# Altium schematic sheet ESP32WROOM-SHEET.SchDoc
size A; SheetNumber: 2; SheetTotal: 3
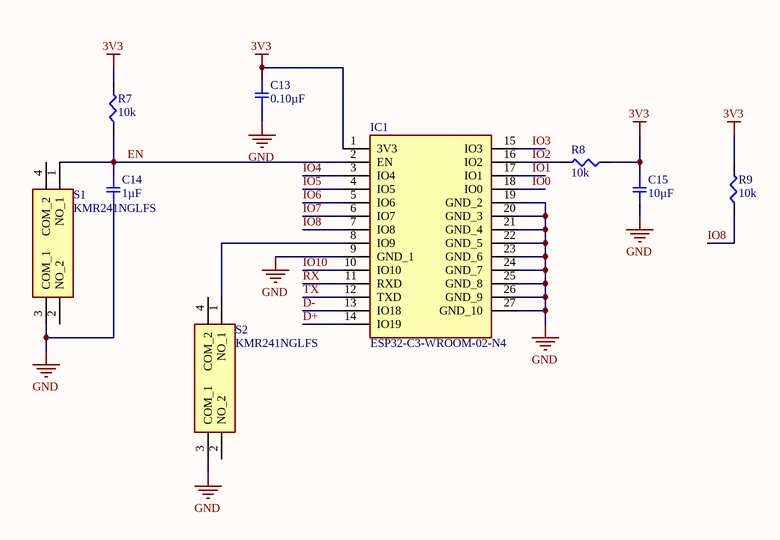
[diagram p0: ESP32WROOM-SHEET.SchDoc]

## Parts
C13  0.10µF  [SMD-0402C]
C14  1µF  [SMD-0402C]
C15  10µF  [SMD-0402C]
IC1  ESP32-C3-WROOM-02-N4  [ESP32C3WROOM02N4]
R7  10k  [SMD-0402-RES]
R8  10k  [SMD-0402-RES]
R9  10k  [SMD-0402-RES]
S1  KMR241NGLFS  [KMR241NGLFS]
S2  KMR241NGLFS  [KMR241NGLFS]

## Nets
3V3: C13.1 C15.1 IC1.1(3V3) R7.2 R8.1 R9.2
GND: C13.2 C14.2 C15.2 IC1.9(GND_1) IC1.19(GND_2) IC1.20(GND_3) IC1.21(GND_4) IC1.22(GND_5) IC1.23(GND_6) IC1.24(GND_7) IC1.25(GND_8) IC1.26(GND_9) IC1.27(GND_10) S1.3(COM_1) S2.3(COM_1)
D+: IC1.14(IO19)
D-: IC1.13(IO18)
EN: C14.1 IC1.2(EN) R7.1 S1.1(NO_1)
IO0: IC1.18(IO0)
IO1: IC1.17(IO1)
IO2: IC1.16(IO2) R8.2
IO3: IC1.15(IO3)
IO4: IC1.3(IO4)
IO5: IC1.4(IO5)
IO6: IC1.5(IO6)
IO7: IC1.6(IO7)
IO8: IC1.7(IO8) R9.1
IO10: IC1.10(IO10)
RX: IC1.11(RXD)
TX: IC1.12(TXD)
NetIC1_8: IC1.8(IO9) S2.1(NO_1)

Not connected (* = marked no-connect by the designer): S1 2(NO_2) 4(COM_2); S2 2(NO_2) 4(COM_2)

## Library data of the parts
C13 = GRM152R61A104KE19D: CAP CER 0.1UF 10V X5R 0402; Manufacturer: Murata Electronics North America; Factory Stock: 0; Unit Price (USD): 0.16; Minimum Quantity: 1; Tolerance: ±10%; Datasheets: http://www.murata.com/~/media/webrenewal/support/library/catalog/products/capacitor/mlcc/c02e.pdf; Image: //media.digikey.com/Renders/Murata%20Renders/ZRB-SERIES-0402.jpg; Digi-Key Part Number: 490-10008-1-ND; Part Number: GRM152R61A104KE19D; Quantity Available: 80241; @ qty: 0; Packaging: Cut Tape (CT); Series: GRM; Part Status: Active; Value: 0.10µF; Voltage: 10V; Temperature Coefficient: X5R; Operating Temperature: -55°C ~ 85°C; Features: Derating Recommended; Ratings: -; Applications: General Purpose; Mounting Type: Surface Mount, MLCC; Package / Case: 0402 (1005 Metric); Size / Dimension: 0.039" L x 0.020" W (1.00mm x 0.50mm); Height - Seated (Max): -; Thickness (Max): 0.009" (0.22mm); Lead Spacing: -; Lead Style: -
C14 = GCM155C71A105KE38D: CAP CER 1UF 10V X7S 0402; Manufacturer: Murata Electronics North America; Factory Stock: 0; Unit Price (USD): 0.12; Minimum Quantity: 1; Tolerance: ±10%; Datasheets: http://www.murata.com/~/media/webrenewal/support/library/catalog/products/capacitor/mlcc/c03e.ashx; Image: //media.digikey.com/Renders/Murata%20Renders/ZRB-SERIES-0402.jpg; Digi-Key Part Number: 490-13409-1-ND; Part Number: GCM155C71A105KE38D; Quantity Available: 7240; @ qty: 0; Packaging: Cut Tape (CT); Series: GCM; Part Status: Active; Value: 1µF; Voltage: 10V; Temperature Coefficient: X7S; Operating Temperature: -55°C ~ 125°C; Features: -; Ratings: AEC-Q200; Applications: Automotive; Mounting Type: Surface Mount, MLCC; Package / Case: 0402 (1005 Metric); Size / Dimension: 0.039" L x 0.020" W (1.00mm x 0.50mm); Height - Seated (Max): -; Thickness (Max): 0.022" (0.55mm); Lead Spacing: -; Lead Style: -
C15 = GRJ155R60J106ME11D: CAP CER 10UF 10V X5R 0402; Manufacturer: Murata Electronics North America; Factory Stock: 0; Unit Price (USD): 0.23; Minimum Quantity: 1; Tolerance: ±20%; Voltage: 6.3V; Datasheets: http://psearch.en.murata.com/capacitor/product/GRJ155R60J106ME11%23.pdf; Image: //media.digikey.com/Renders/Murata%20Renders/ZRB-SERIES-0402.jpg; Digi-Key Part Number: 490-13211-1-ND; Part Number: GRJ155R60J106ME11D; Quantity Available: 64064; @ qty: 0; Packaging: Cut Tape (CT); Series: GRJ; Part Status: Active; Value: 10µF; Temperature Coefficient: X5R; Operating Temperature: -55°C ~ 85°C; Features: Derating Recommended, Soft Termination; Ratings: -; Applications: Boardflex Sensitive; Mounting Type: Surface Mount, MLCC; Package / Case: 0402 (1005 Metric); Size / Dimension: 0.039" L x 0.020" W (1.00mm x 0.50mm); Height - Seated (Max): -; Thickness (Max): 0.028" (0.70mm); Lead Spacing: -; Lead Style: -
IC1 = ESP32-C3-WROOM-02-N4: Integrated Circuit; Manufacturer_Name: Espressif Systems; Datasheet Link: https://www.mouser.ch/datasheet/2/891/Espressif_ESP32_C3_WROOM_02-2006871.pdf; Height: 3.35mm; Manufacturer_Part_Number: ESP32-C3-WROOM-02-N4; Mouser Part Number: 356-ESP32C3WROOM02N4; Mouser Price/Stock: https://www.mouser.co.uk/ProductDetail/Espressif-Systems/ESP32-C3-WROOM-02-N4?qs=stqOd1AaK7%2FqjTZKEOgfUg%3D%3D
R7-R9 = ERJ-2GEJ103X: RES SMD 10K OHM 5% 1/10W 0402; Manufacturer: Panasonic Electronic Components; Factory Stock: 0; Unit Price (USD): 0.00350; @ qty: 1500; Minimum Quantity: 1; Power (Watts): 0.1W, 1/10W; Temperature Coefficient: ±200ppm/°C; Part Number: ERJ-2GEJ103X; Datasheets: http://industrial.panasonic.com/www-cgi/jvcr13pz.cgi?E+PZ+3+AOA0001+ERJ2GEJ103X+7+WW; Image: //media.digikey.com/Photos/Panasonic%20Photos/ERJ-PA2-Series.jpg; Digi-Key Part Number: P10KJCT-ND; Quantity Available: 2560215; Packaging: Cut Tape (CT); Series: ERJ; Part Status: Active; Value: 10k; Tolerance: ±5%; Composition: Thick Film; Features: Automotive AEC-Q200; Operating Temperature: -55°C ~ 155°C; Package / Case: 0402 (1005 Metric); Supplier Device Package: 0402; Size / Dimension: 0.039" L x 0.020" W (1.00mm x 0.50mm); Height - Seated (Max): 0.016" (0.40mm); Number of Terminations: 2; Failure Rate: -
S1 S2 = KMR241NGLFS: Switch; Manufacturer_Name: C & K COMPONENTS; Datasheet Link: https://www.ckswitches.com/media/1479/kmr2.pdf; Height: 1.9mm; Manufacturer_Part_Number: KMR241NGLFS; Mouser Part Number: 611-KMR241NGLFS; Mouser Price/Stock: https://www.mouser.co.uk/ProductDetail/CK/KMR241NGLFS?qs=sb%252But3Lm4x3MOq2auuFbeg%3D%3D; Arrow Part Number: KMR241NGLFS; Arrow Price/Stock: https://www.arrow.com/en/products/kmr241nglfs/ck